# Altium project TPS65217_Test_Bd.PrjPcb
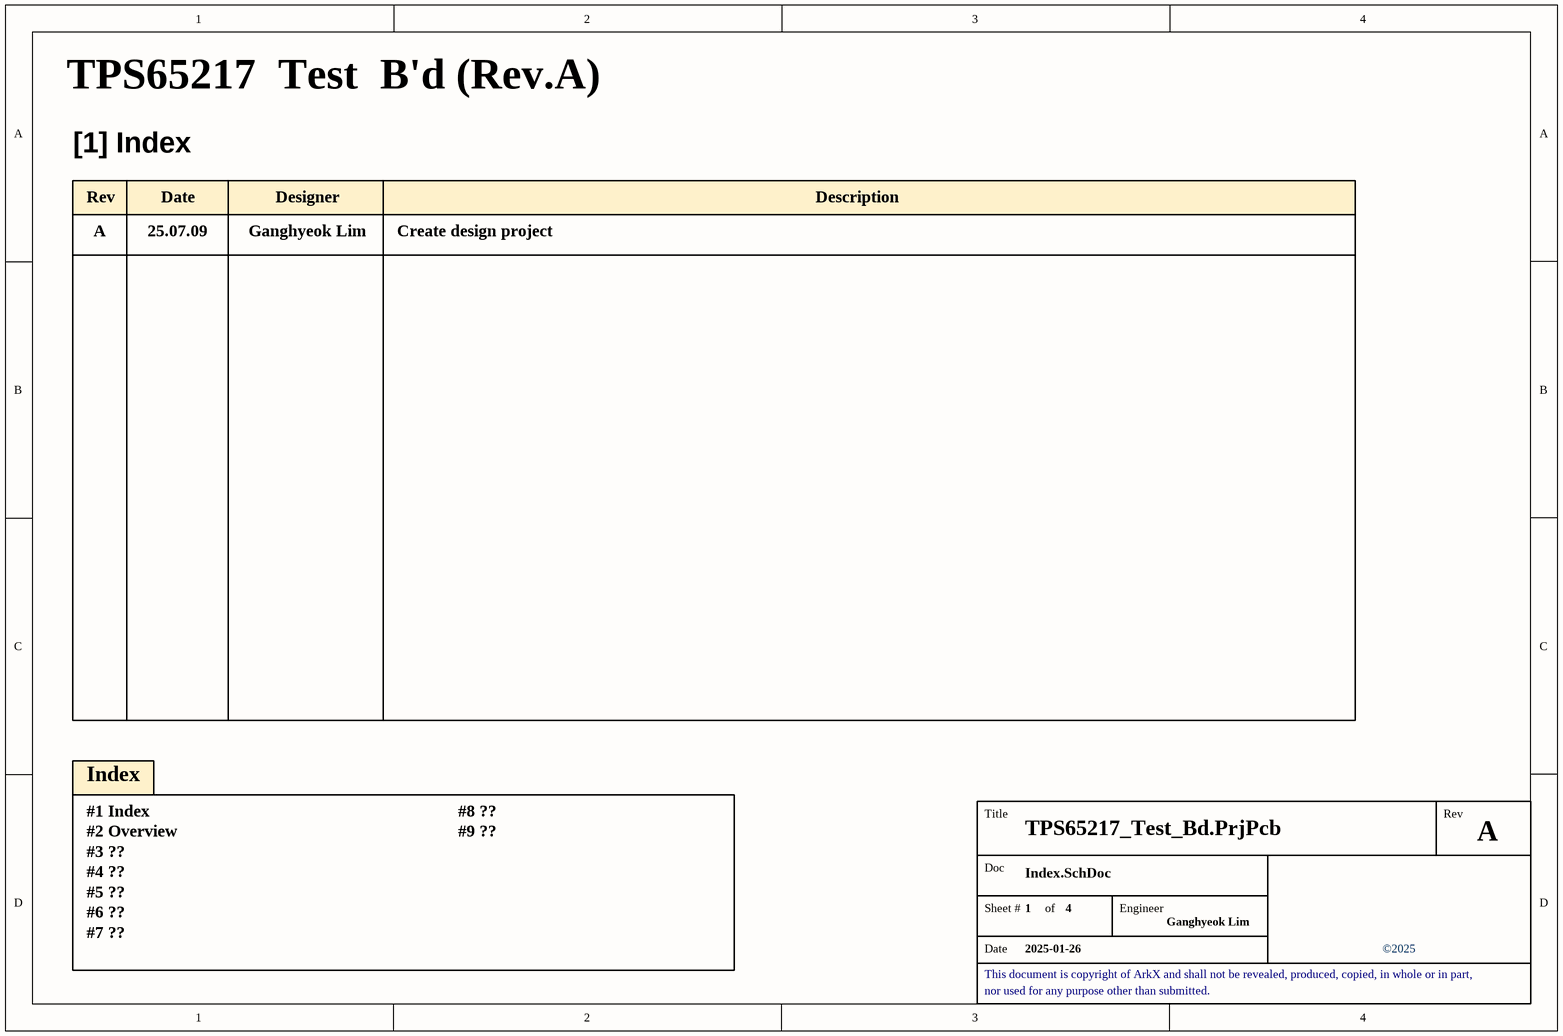
[diagram p0: Index.SchDoc]
5 sheets, 111 parts. Net scope: flat (ports and power ports of the same name join across sheets).
Board file: TPS65217_Test_Bd.PcbDoc
Sheets:
  Index.SchDoc
  Overview.SchDoc
  TPS65217DRSLR.SchDoc
  MCU.SchDoc
  Connector.SchDoc

## Sheet Index.SchDoc
size A4; Date: 2025-01-26; Engineer: Ganghyeok Lim; Revision: A; SheetNumber: 1; SheetTotal: 4

### Notes on the sheet
- TPS65217  Test  B'd (Rev.A)
- [1] Index
- Rev
- A
- 25.07.09
- Date
- Ganghyeok Lim
- Designer
- Create design project
- Description
- Index
- #1 Index
- #2 Overview
- #8 ??
- #9 ??
- #3 ??
- #4 ??
- #5 ??
- #6 ??
- #7 ??
- Title
- Doc
- Sheet #
- of
- Engineer
- This document is copyright of ArkX and shall not be revealed, produced, copied, in whole or in part,
- ©2025
- nor used for any purpose other than submitted.

## Sheet Overview.SchDoc
size A4; SheetNumber: 2; SheetTotal: 4
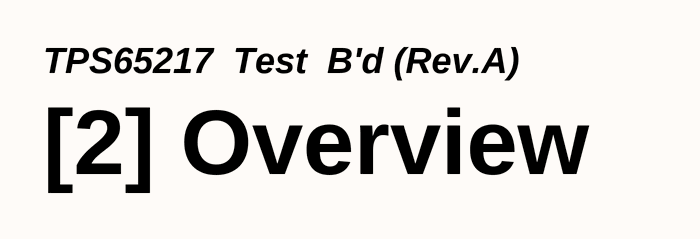
[diagram p1: Overview.SchDoc]

### Notes on the sheet
- TPS65217  Test  B'd (Rev.A)
- [2] Overview
- Title
- Rev
- Doc
- Sheet #
- of
- Engineer
- This document is copyright of ArkX and shall not be revealed, produced, copied, in whole or in part,
- Date
- nor used for any purpose other than submitted.

## Sheet TPS65217DRSLR.SchDoc
size A3; SheetNumber: 3; SheetTotal: 5
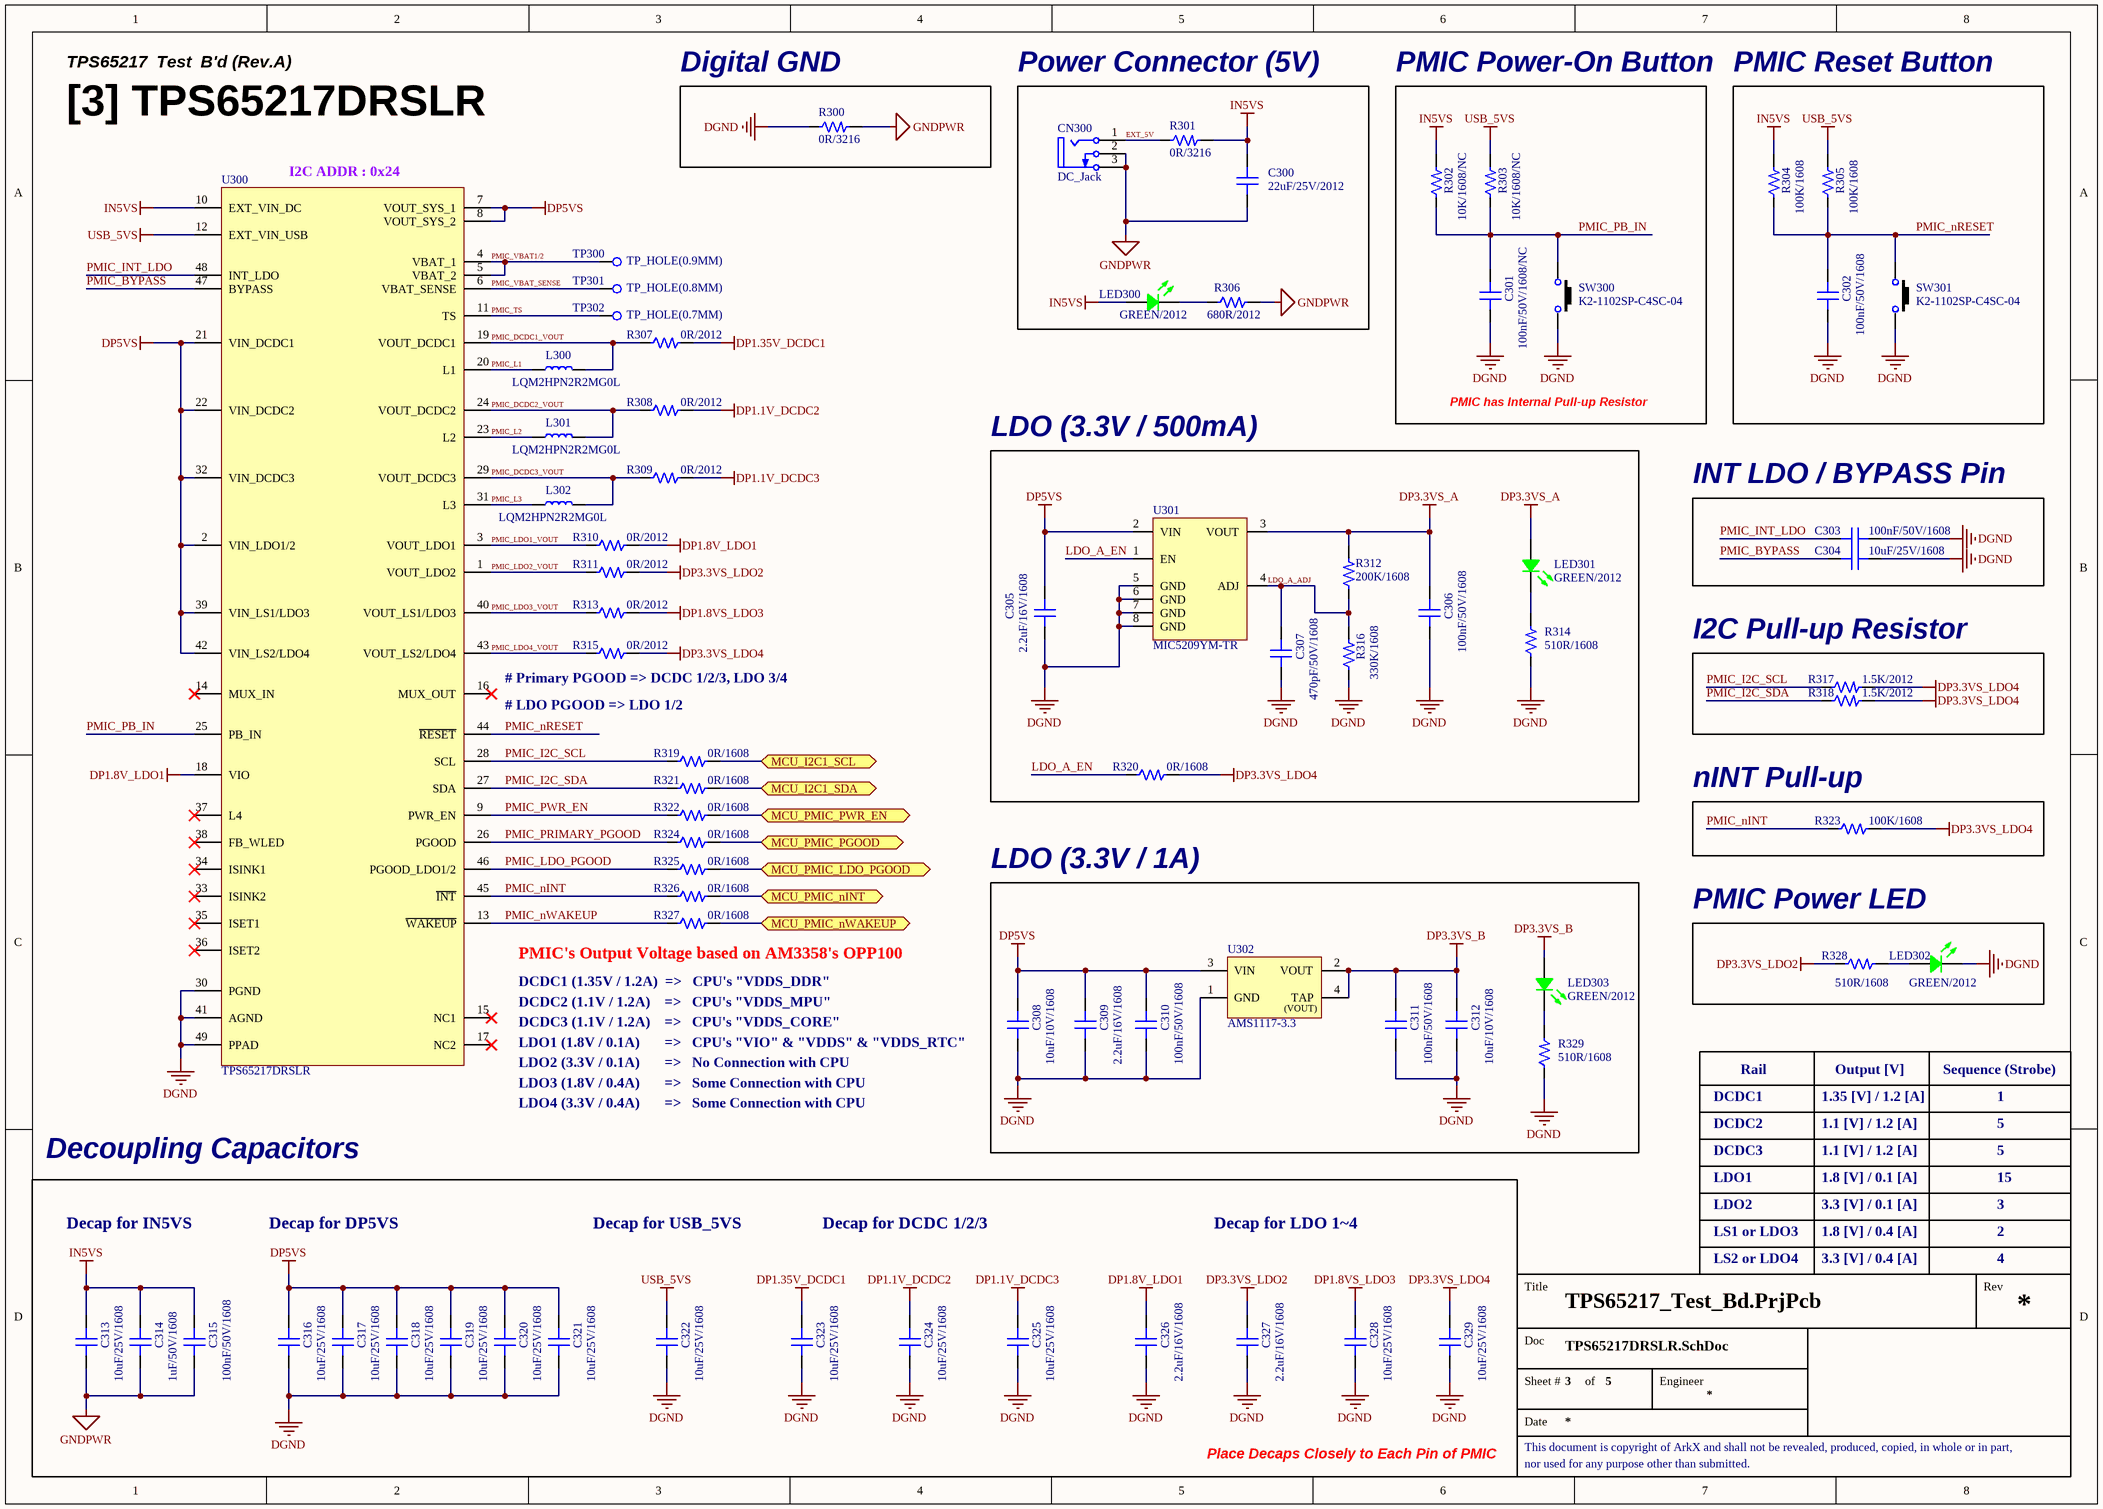
[diagram p2: TPS65217DRSLR.SchDoc]

### Parts
C300  22uF/25V/2012  [CAP 2012 (0805_INCH)]
C301  100nF/50V/1608/NC  [CAP 1608 (0603_INCH)/NC]
C302  100nF/50V/1608  [CAP 1608 (0603_INCH)]
C303  100nF/50V/1608  [CAP 1608 (0603_INCH)]
C304  10uF/25V/1608  [CAP 1608 (0603_INCH)]
C305  2.2uF/16V/1608  [CAP 1608 (0603_INCH)]
C306  100nF/50V/1608  [CAP 1608 (0603_INCH)]
C307  470pF/50V/1608  [CAP 1608 (0603_INCH)]
C308  10uF/10V/1608  [CAP 1608 (0603_INCH)]
C309  2.2uF/16V/1608  [CAP 1608 (0603_INCH)]
C310  100nF/50V/1608  [CAP 1608 (0603_INCH)]
C311  100nF/50V/1608  [CAP 1608 (0603_INCH)]
C312  10uF/10V/1608  [CAP 1608 (0603_INCH)]
C313  10uF/25V/1608  [CAP 1608 (0603_INCH)]
C314  1uF/50V/1608  [CAP 1608 (0603_INCH)]
C315  100nF/50V/1608  [CAP 1608 (0603_INCH)]
C316  10uF/25V/1608  [CAP 1608 (0603_INCH)]
C317  10uF/25V/1608  [CAP 1608 (0603_INCH)]
C318  10uF/25V/1608  [CAP 1608 (0603_INCH)]
C319  10uF/25V/1608  [CAP 1608 (0603_INCH)]
C320  10uF/25V/1608  [CAP 1608 (0603_INCH)]
C321  10uF/25V/1608  [CAP 1608 (0603_INCH)]
C322  10uF/25V/1608  [CAP 1608 (0603_INCH)]
C323  10uF/25V/1608  [CAP 1608 (0603_INCH)]
C324  10uF/25V/1608  [CAP 1608 (0603_INCH)]
C325  10uF/25V/1608  [CAP 1608 (0603_INCH)]
C326  2.2uF/16V/1608  [CAP 1608 (0603_INCH)]
C327  2.2uF/16V/1608  [CAP 1608 (0603_INCH)]
C328  10uF/25V/1608  [CAP 1608 (0603_INCH)]
C329  10uF/25V/1608  [CAP 1608 (0603_INCH)]
CN300  DC_Jack  [CON_DC-JACK]
L300  LQM2HPN2R2MG0L  [IND_LQM2HPN2R2MG0L]
L301  LQM2HPN2R2MG0L  [IND_LQM2HPN2R2MG0L]
L302  LQM2HPN2R2MG0L  [IND_LQM2HPN2R2MG0L]
LED300  GREEN/2012  [LED MHT170RGBCT (GREEN)]
LED301  GREEN/2012  [LED MHT170RGBCT (GREEN)]
LED302  GREEN/2012  [LED MHT170RGBCT (GREEN)]
LED303  GREEN/2012  [LED MHT170RGBCT (GREEN)]
R300  0R/3216  [RES 3216 (1206_inch)]
R301  0R/3216  [RES 3216 (1206_inch)]
R302  10K/1608/NC  [RES 1608 (0603_inch)/NC]
R303  10K/1608/NC  [RES 1608 (0603_inch)/NC]
R304  100K/1608  [RES 1608 (0603_inch)]
R305  100K/1608  [RES 1608 (0603_inch)]
R306  680R/2012  [RES 2012 (0805_inch)]
R307  0R/2012  [RES 2012 (0805_inch)]
R308  0R/2012  [RES 2012 (0805_inch)]
R309  0R/2012  [RES 2012 (0805_inch)]
R310  0R/2012  [RES 2012 (0805_inch)]
R311  0R/2012  [RES 2012 (0805_inch)]
R312  200K/1608  [RES 1608 (0603_inch)]
R313  0R/2012  [RES 2012 (0805_inch)]
R314  510R/1608  [RES 1608 (0603_inch)]
R315  0R/2012  [RES 2012 (0805_inch)]
R316  330K/1608  [RES 1608 (0603_inch)]
R317  1.5K/2012  [RES 2012 (0805_inch)]
R318  1.5K/2012  [RES 2012 (0805_inch)]
R319  0R/1608  [RES 1608 (0603_inch)]
R320  0R/1608  [RES 1608 (0603_inch)]
R321  0R/1608  [RES 1608 (0603_inch)]
R322  0R/1608  [RES 1608 (0603_inch)]
R323  100K/1608  [RES 1608 (0603_inch)]
R324  0R/1608  [RES 1608 (0603_inch)]
R325  0R/1608  [RES 1608 (0603_inch)]
R326  0R/1608  [RES 1608 (0603_inch)]
R327  0R/1608  [RES 1608 (0603_inch)]
R328  510R/1608  [RES 1608 (0603_inch)]
R329  510R/1608  [RES 1608 (0603_inch)]
SW300  K2-1102SP-C4SC-04  [SW K2-1102SP-C4SC-04]
SW301  K2-1102SP-C4SC-04  [SW K2-1102SP-C4SC-04]
TP300  TP_HOLE(0.9MM)  [TP_HOLE(0.9MM)]
TP301  TP_HOLE(0.8MM)  [TP_HOLE(0.8MM)]
TP302  TP_HOLE(0.7MM)  [TP_HOLE(0.7MM)]
U300  TPS65217DRSLR  [IC_VQFN-48(6x6)]
U301  MIC5209YM-TR  [IC_SOIC-8 (4.90x3.90mm)]
U302  AMS1117-3.3  [SOT 223-3 (DIODES INCORPORATED)]

### Blocks framed on the sheet
Digital GND: R300
Power Connector (5V): C300 CN300 LED300 R301 R306
PMIC Power-On Button: C301 R302 R303 SW300
PMIC Reset Button: C302 R304 R305 SW301
LDO (3.3V / 500mA): C305-C307 LED301 R312 R314 R316 R320 U301
INT LDO / BYPASS Pin: C303 C304
I2C Pull-up Resistor: R317 R318
nINT Pull-up: R323
LDO (3.3V / 1A): C308-C312 LED303 R329 U302
PMIC Power LED: LED302 R328
Decoupling Capacitors: C313-C329

### Ports
MCU_I2C1_SCL (bidir), MCU_I2C1_SDA (bidir), MCU_PMIC_LDO_PGOOD (bidir), MCU_PMIC_nINT (bidir), MCU_PMIC_nWAKEUP (bidir), MCU_PMIC_PGOOD (bidir), MCU_PMIC_PWR_EN (bidir)

### Nets
DGND: C301.1 C302.1 C303.1 C304.1 C305.1 C306.1 C307.1 C308.1 C309.1 C310.1 C311.1 C312.1 C316.1 C317.1 C318.1 C319.1 C320.1 C321.1 C322.1 C323.1 C324.1 C325.1 C326.1 C327.1 C328.1 C329.1 LED302.2(GREEN) R300.1 R314.1 R316.1 R329.1 SW300.3 SW301.3 U300.30(PGND) U300.41(AGND) U300.49(PPAD) U301.5(GND) U301.6(GND) U301.7(GND) U301.8(GND) U302.1(GND)
DP1.1V_DCDC2: C324.2 R308.2
DP1.1V_DCDC3: C325.2 R309.2
DP1.8V_LDO1: C326.2 R310.2 U300.18(VIO)
DP1.8VS_LDO3: C328.2 R313.2
DP1.35V_DCDC1: C323.2 R307.2
DP3.3VS_A: C306.2 LED301.4(Common_Anode) R312.2 U301.3(VOUT)
DP3.3VS_B: C311.2 C312.2 LED303.4(Common_Anode) U302.2(VOUT) U302.4(TAP)
DP3.3VS_LDO2: C327.2 R311.2 R328.1
DP3.3VS_LDO4: C329.2 R315.2 R317.2 R318.2 R320.2 R323.2
DP5VS: C305.2 C308.2 C309.2 C310.2 C316.2 C317.2 C318.2 C319.2 C320.2 C321.2 U300.2(VIN_LDO1/2) U300.7(VOUT_SYS_1) U300.8(VOUT_SYS_2) U300.21(VIN_DCDC1) U300.22(VIN_DCDC2) U300.32(VIN_DCDC3) U300.39(VIN_LS1/LDO3) U300.42(VIN_LS2/LDO4) U301.2(VIN) U302.3(VIN)
GNDPWR: C300.1 C313.1 C314.1 C315.1 CN300.2(GND) CN300.3(GND) R300.2 R306.2
IN5VS: C300.2 C313.2 C314.2 C315.2 LED300.4(Common_Anode) R301.2 R302.2 R304.2 U300.10(EXT_VIN_DC)
USB_5VS: C322.2 R303.2 R305.2 U300.12(EXT_VIN_USB)
EXT_5V: CN300.1(VCC) R301.1
LDO_A_ADJ: C307.2 R312.1 R316.2 U301.4(ADJ)
LDO_A_EN: R320.1 U301.1(EN)
MCU_I2C1_SCL: R319.2 ; port MCU_I2C1_SCL
MCU_I2C1_SDA: R321.2 ; port MCU_I2C1_SDA
MCU_PMIC_LDO_PGOOD: R325.2 ; port MCU_PMIC_LDO_PGOOD
MCU_PMIC_nINT: R326.2 ; port MCU_PMIC_nINT
MCU_PMIC_nWAKEUP: R327.2 ; port MCU_PMIC_nWAKEUP
MCU_PMIC_PGOOD: R324.2 ; port MCU_PMIC_PGOOD
MCU_PMIC_PWR_EN: R322.2 ; port MCU_PMIC_PWR_EN
PMIC_BYPASS: C304.2 U300.47(BYPASS)
PMIC_DCDC1_VOUT: L300.2 R307.1 U300.19(VOUT_DCDC1)
PMIC_DCDC2_VOUT: L301.2 R308.1 U300.24(VOUT_DCDC2)
PMIC_DCDC3_VOUT: L302.2 R309.1 U300.29(VOUT_DCDC3)
PMIC_I2C_SCL: R317.1 R319.1 U300.28(SCL)
PMIC_I2C_SDA: R318.1 R321.1 U300.27(SDA)
PMIC_INT_LDO: C303.2 U300.48(INT_LDO)
PMIC_L1: L300.1 U300.20(L1)
PMIC_L2: L301.1 U300.23(L2)
PMIC_L3: L302.1 U300.31(L3)
PMIC_LDO1_VOUT: R310.1 U300.3(VOUT_LDO1)
PMIC_LDO2_VOUT: R311.1 U300.1(VOUT_LDO2)
PMIC_LDO3_VOUT: R313.1 U300.40(VOUT_LS1/LDO3)
PMIC_LDO4_VOUT: R315.1 U300.43(VOUT_LS2/LDO4)
PMIC_LDO_PGOOD: R325.1 U300.46(PGOOD_LDO1/2)
PMIC_nINT: R323.1 R326.1 U300.45(~{INT})
PMIC_nRESET: C302.2 R304.1 R305.1 SW301.1 U300.44(~{RESET})
PMIC_nWAKEUP: R327.1 U300.13(~{WAKEUP})
PMIC_PB_IN: C301.2 R302.1 R303.1 SW300.1 U300.25(PB_IN)
PMIC_PRIMARY_PGOOD: R324.1 U300.26(PGOOD)
PMIC_PWR_EN: R322.1 U300.9(PWR_EN)
PMIC_TS: TP302.1(TP) U300.11(TS)
PMIC_VBAT1/2: TP300.1(TP) U300.4(VBAT_1) U300.5(VBAT_2)
PMIC_VBAT_SENSE: TP301.1(TP) U300.6(VBAT_SENSE)
NetLED300_2: LED300.2(GREEN) R306.1
NetLED301_2: LED301.2(GREEN) R314.2
NetLED302_4: LED302.4(Common_Anode) R328.2
NetLED303_2: LED303.2(GREEN) R329.2

Not connected (* = marked no-connect by the designer): U300 14(MUX_IN)* 15(NC1)* 16(MUX_OUT)* 17(NC2)* 33(ISINK2)* 34(ISINK1)* 35(ISET1)* 36(ISET2)* 37(L4)* 38(FB_WLED)*

### Notes on the sheet
- TPS65217  Test  B'd (Rev.A)
- [3] TPS65217DRSLR
- (near U300) I2C ADDR : 0x24
- PMIC has Internal Pull-up Resistor
- # LDO PGOOD => LDO 1/2
- (near R315) # Primary PGOOD => DCDC 1/2/3, LDO 3/4
- DCDC1 (1.35V / 1.2A)  =>   CPU's "VDDS_DDR"
- (near R327) PMIC's Output Voltage based on AM3358's OPP100
- DCDC2 (1.1V / 1.2A)    =>   CPU's "VDDS_MPU"
- DCDC3 (1.1V / 1.2A)    =>   CPU's "VDDS_CORE"
- LDO1 (1.8V / 0.1A)       =>   CPU's "VIO" & "VDDS" & "VDDS_RTC"
- LDO2 (3.3V / 0.1A)       =>   No Connection with CPU
- LDO3 (1.8V / 0.4A)       =>   Some Connection with CPU
- LDO4 (3.3V / 0.4A)       =>   Some Connection with CPU
- DCDC1
- DCDC2
- Rail
- 1.35 [V] / 1.2 [A]
- 1.1 [V] / 1.2 [A]
- Output [V]
- Sequence (Strobe)
- 1
- 5
- DCDC3
- LDO1
- 1.8 [V] / 0.1 [A]
- 15
- Decap for IN5VS
- Decap for DP5VS
- Decap for USB_5VS
- Decap for DCDC 1/2/3
- Decap for LDO 1~4
- LDO2
- LS1 or LDO3
- LS2 or LDO4
- 3.3 [V] / 0.1 [A]
- 1.8 [V] / 0.4 [A]
- 3.3 [V] / 0.4 [A]
- 3
- 2
- 4
- Place Decaps Closely to Each Pin of PMIC
- Title
- Rev
- Doc
- Sheet #
- of
- Engineer
- This document is copyright of ArkX and shall not be revealed, produced, copied, in whole or in part,
- Date
- nor used for any purpose other than submitted.
- (in symbol IC_REG_AMS1117-3.3) (VOUT)

### Library data of the parts
C300 = CAP_22uF/25V/2012: Ceramic CAP_22uF/25V/2012; LCSC Part #: C45783; JLCPCB Part Type: Basic Part
C301 = CAP_NC_100nF/50V/1608: Ceramic CAP_100nF/50V/1608
C302 C303 C306 C310 C311 C315 = CAP_100nF/50V/1608: Ceramic CAP_100nF/50V/1608; LCSC Part #: C14663; JLCPCB Part Type: Basic Part
C304 C313 C316-C325 C328 C329 = CAP_10uF/25V/1608: Ceramic CAP_10uF/25V/1608; LCSC Part #: C96446; JLCPCB Part Type: Basic Part
C305 C309 C326 C327 = CAP_2.2uF/16V/1608: Ceramic CAP_2.2uF/16V/1608; LCSC Part #: C23630; JLCPCB Part Type: Basic Part
C307 = CAP_470pF/50V/1608: Ceramic CAP_470pF/50V/1608; LCSC Part #: C1620; JLCPCB Part Type: Basic Part
C308 C312 = CAP_10uF/10V/1608: Ceramic CAP_10uF/10V/1608; LCSC Part #: C19702; JLCPCB Part Type: Basic Part
C314 = CAP_1uF/50V/1608: Ceramic CAP_1uF/50V/1608; LCSC Part #: C15849; JLCPCB Part Type: Basic Part
CN300 = CON_DC-Jack: ComponentLink1Description: Manufacturer Link; ComponentLink1URL: http://www.cliffuk.co.uk/
L300-L302 = IND_LQM2HPN2R2MG0L: 2.2 µH Shielded Multilayer Inductor 1.3 A 100mOhm Max 1008 (2520 Metric); LCSC Part #: C86092; JLCPCB Part Type: Extended Part
LED300-LED303 = LED_MHT170RGBCT(GREEN): Colorless transparence -30℃~+85℃ Positive post Common anode RGB 120° 0805  Light Emitting Diodes (LED) ROHS; LCSC Part #: C2962094; JLCPCB Part Type: Extended Part
R300 R301 = RES_0R/3216/0.25W: Power Rating: 0.1W; Precision: 1%; Size: 1608; LCSC Part #: C17888; JLCPCB Part Type: Basic Part
R302 R303 = RES_NC_10K/1608/0.1W: RES_10K/1608/0.1W; Value: 10K; Power Rating: 0.1W; Precision: 1%; Size: 1608
R304 R305 R323 = RES_100K/1608/0.1W: Value: 100K; Power Rating: 0.1W; Precision: 1%; Size: 1608; LCSC Part #: C25803; JLCPCB Part Type: Basic Part
R306 = RES_680R/2012/0.125W: Value: 680R; Power Rating: 0.125W; Precision: 1%; Size: 2012; LCSC Part #: C17798; JLCPCB Part Type: Basic Part
R307-R311 R313 R315 = RES_0R/2012/0.125W: Value: 0R; Power Rating: 0.125W; Precision: 1%; Size: 2012; LCSC Part #: C17477; JLCPCB Part Type: Basic Part
R312 = RES_200K/1608/0.1W: Value: 200K; Power Rating: 0.1W; Precision: 1%; Size: 1608; LCSC Part #: C25811; JLCPCB Part Type: Basic Part
R314 R328 R329 = RES_510R/1608/0.1W: Value: 510R; Power Rating: 0.1W; Precision: 1%; Size: 1608; LCSC Part #: C23193; JLCPCB Part Type: Basic Part
R316 = RES_330K/1608/0.1W: Value: 330K; Power Rating: 0.1W; Precision: 1%; Size: 1608; LCSC Part #: C23137; JLCPCB Part Type: Basic Part
R317 R318 = RES_1.5K/2012/0.125W: Value: 1.5K; Power Rating: 0.125W; Precision: 1%; Size: 2012; LCSC Part #: C4310; JLCPCB Part Type: Basic Part
R319-R322 R324-R327 = RES_0R/1608/0.1W: Value: 0R; Power Rating: 0.1W; Precision: 1%; Size: 1608; LCSC Part #: C21189; JLCPCB Part Type: Basic Part
SW300 SW301 = SW_K2-1102SP-C4SC-04(2P): -25℃~+85℃ 6mm 5mm Round Button 50mA Brick nogging 6mm SPST 100MΩ 100000 250gf@±30gf 12V SMD  Tactile Switches ROHS; LCSC Part #: C127509; JLCPCB Part Type: Extended Part
U300 = IC_PMIC_TPS65217DRSLR: Battery Management, Display (LED Drivers), Handheld/Mobile Devices, Power Supply PMIC 48-VQFN (6x6); ComponentLink1Description: Datasheet; ComponentLink1URL: https://www.mouser.kr/datasheet/2/609/8023fj-2488599.pdf; LCSC Part #: C702315; JLCPCB Part Type: Extended Part
U301 = IC_REG_MIC5209YM-TR: Linear Voltage Regulator IC Positive Adjustable 1 Output 500mA 8-SOIC; LCSC Part #: C461593; JLCPCB Part Type: Extended Part
U302 = IC_REG_AMS1117-3.3: 72dB@(120Hz) 1A 1.3V@(800mA) Fixed 3.3V~3.3V Positive 1 SOT-223  Linear Voltage Regulators (LDO) ROHS; LCSC Part #: C6186; JLCPCB Part Type: Basic Part

## Sheet MCU.SchDoc
size A4; SheetNumber: 4; SheetTotal: 5
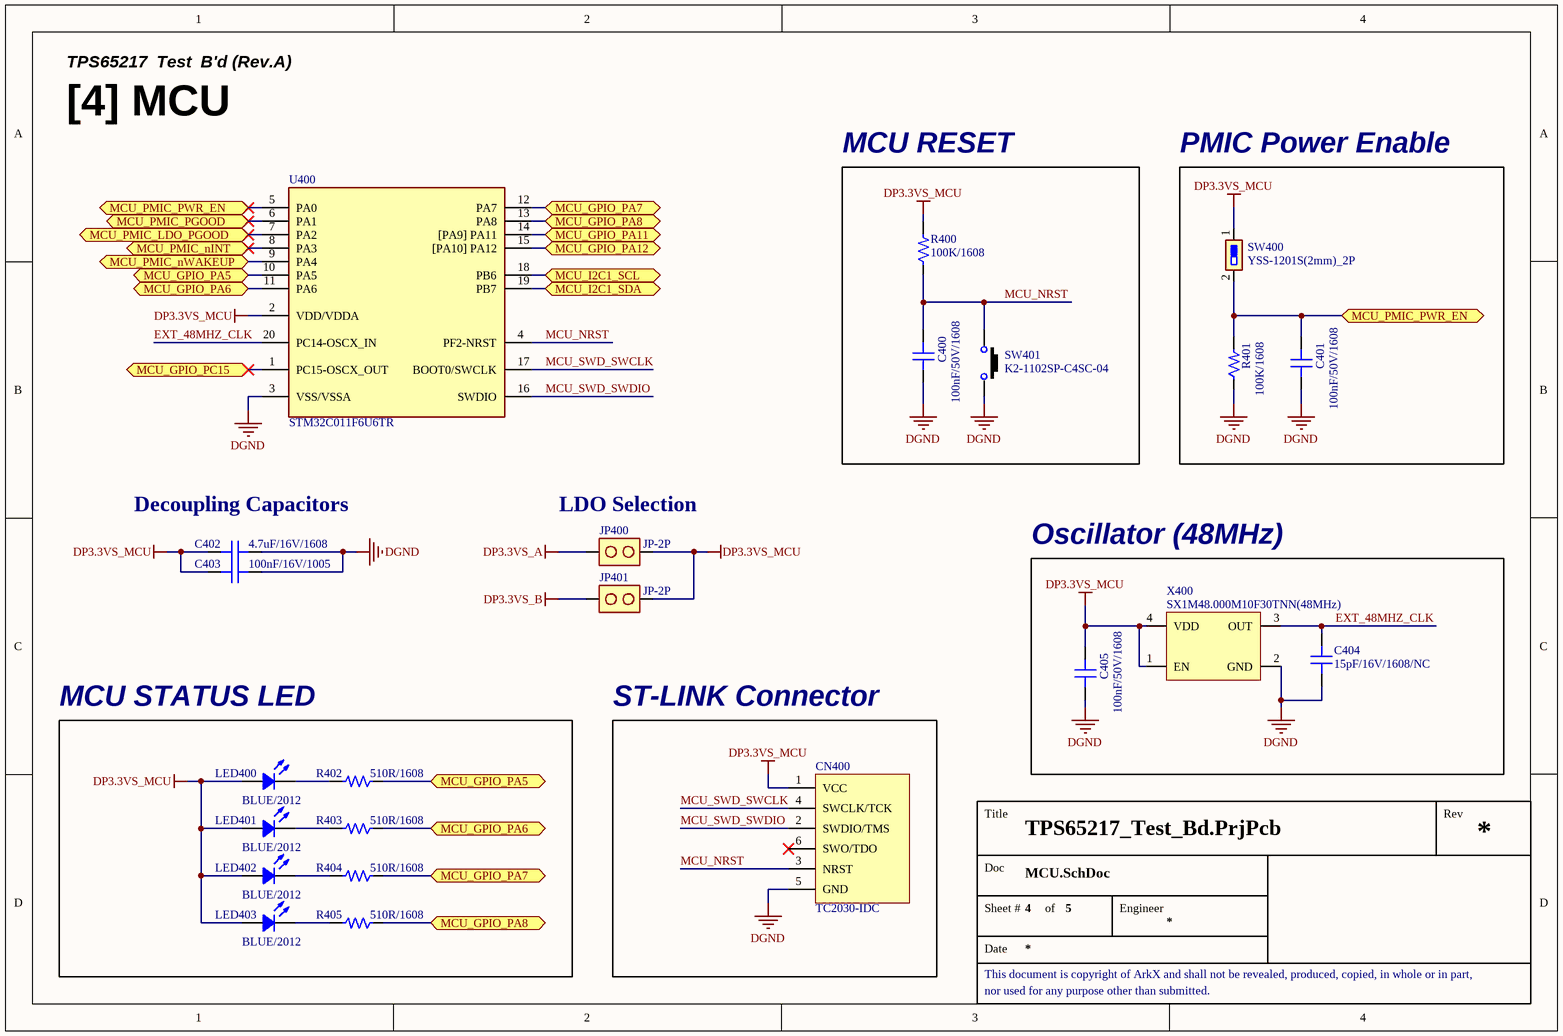
[diagram p3: MCU.SchDoc]

### Parts
C400  100nF/50V/1608  [CAP 1608 (0603_INCH)]
C401  100nF/50V/1608  [CAP 1608 (0603_INCH)]
C402  4.7uF/16V/1608  [CAP 1608 (0603_INCH)]
C403  100nF/16V/1005  [CAP 1005 (0402_INCH)]
C404  15pF/16V/1608/NC  [CAP 1608 (0603_INCH)/NC]
C405  100nF/50V/1608  [CAP 1608 (0603_INCH)]
CN400  TC2030-IDC  [CON_TC2030-IDC]  (no BOM)
JP400  JP-2P  [CON PIN_HEADER-2PIN(2.54MM)]
JP401  JP-2P  [CON PIN_HEADER-2PIN(2.54MM)]
LED400  BLUE/2012  [LED MHT170RGBCT (BLUE)]
LED401  BLUE/2012  [LED MHT170RGBCT (BLUE)]
LED402  BLUE/2012  [LED MHT170RGBCT (BLUE)]
LED403  BLUE/2012  [LED MHT170RGBCT (BLUE)]
R400  100K/1608  [RES 1608 (0603_inch)]
R401  100K/1608  [RES 1608 (0603_inch)]
R402  510R/1608  [RES 1608 (0603_inch)]
R403  510R/1608  [RES 1608 (0603_inch)]
R404  510R/1608  [RES 1608 (0603_inch)]
R405  510R/1608  [RES 1608 (0603_inch)]
SW400  YSS-1201S(2mm)_2P  [SW YSS-1201S-2mm]
SW401  K2-1102SP-C4SC-04  [SW K2-1102SP-C4SC-04]
U400  STM32C011F6U6TR  [IC_UFQFPN-20]
X400  SX1M48.000M10F30TNN(48MHz)  [OSC_SMD2016-4P]

### Blocks framed on the sheet
MCU RESET: C400 R400 SW401
PMIC Power Enable: C401 R401 SW400
Oscillator (48MHz): C404 C405 X400
MCU STATUS LED: LED400-LED403 R402-R405
ST-LINK Connector: CN400

### Ports
MCU_GPIO_PA5 (bidir), MCU_GPIO_PA6 (bidir), MCU_GPIO_PA7 (bidir), MCU_GPIO_PA8 (bidir), MCU_GPIO_PA11 (bidir), MCU_GPIO_PA12 (bidir), MCU_GPIO_PC15 (bidir), MCU_I2C1_SCL (bidir), MCU_I2C1_SDA (bidir), MCU_PMIC_LDO_PGOOD (bidir), MCU_PMIC_nINT (bidir), MCU_PMIC_nWAKEUP (bidir), MCU_PMIC_PGOOD (bidir), MCU_PMIC_PWR_EN (bidir)

### Nets
DGND: C400.1 C401.1 C402.1 C403.1 C404.1 C405.1 CN400.5(GND) R401.1 SW401.3 U400.3(VSS/VSSA) X400.2(GND)
DP3.3VS_A: JP400.1
DP3.3VS_B: JP401.1
DP3.3VS_MCU: C402.2 C403.2 C405.2 CN400.1(VCC) JP400.2 JP401.2 LED400.4(Common_Anode) LED401.4(Common_Anode) LED402.4(Common_Anode) LED403.4(Common_Anode) R400.2 SW400.1 U400.2(VDD/VDDA) X400.1(EN) X400.4(VDD)
EXT_48MHZ_CLK: C404.2 U400.20(PC14-OSCX_IN) X400.3(OUT)
MCU_GPIO_PA5: R402.1 U400.10(PA5) ; port MCU_GPIO_PA5
MCU_GPIO_PA6: R403.1 U400.11(PA6) ; port MCU_GPIO_PA6
MCU_GPIO_PA7: R404.1 U400.12(PA7) ; port MCU_GPIO_PA7
MCU_GPIO_PA8: R405.1 U400.13(PA8) ; port MCU_GPIO_PA8
MCU_GPIO_PA11: U400.14([PA9]_PA11) ; port MCU_GPIO_PA11
MCU_GPIO_PA12: U400.15([PA10]_PA12) ; port MCU_GPIO_PA12
MCU_GPIO_PC15: U400.1(PC15-OSCX_OUT) ; port MCU_GPIO_PC15
MCU_I2C1_SCL: U400.18(PB6) ; port MCU_I2C1_SCL
MCU_I2C1_SDA: U400.19(PB7) ; port MCU_I2C1_SDA
MCU_NRST: C400.2 CN400.3(NRST) R400.1 SW401.1 U400.4(PF2-NRST)
MCU_PMIC_LDO_PGOOD: U400.7(PA2) ; port MCU_PMIC_LDO_PGOOD
MCU_PMIC_nINT: U400.8(PA3) ; port MCU_PMIC_nINT
MCU_PMIC_nWAKEUP: U400.9(PA4) ; port MCU_PMIC_nWAKEUP
MCU_PMIC_PGOOD: U400.6(PA1) ; port MCU_PMIC_PGOOD
MCU_PMIC_PWR_EN: C401.2 R401.2 SW400.2 U400.5(PA0) ; port MCU_PMIC_PWR_EN
MCU_SWD_SWCLK: CN400.4(SWCLK/TCK) U400.17(BOOT0/SWCLK)
MCU_SWD_SWDIO: CN400.2(SWDIO/TMS) U400.16(SWDIO)
NetLED400_3: LED400.3(BLUE) R402.2
NetLED401_3: LED401.3(BLUE) R403.2
NetLED402_3: LED402.3(BLUE) R404.2
NetLED403_3: LED403.3(BLUE) R405.2

Not connected (* = marked no-connect by the designer): CN400 6(SWO/TDO)*

### Notes on the sheet
- TPS65217  Test  B'd (Rev.A)
- [4] MCU
- Decoupling Capacitors
- (near JP400) LDO Selection
- Title
- Rev
- Doc
- Sheet #
- of
- Engineer
- This document is copyright of ArkX and shall not be revealed, produced, copied, in whole or in part,
- Date
- nor used for any purpose other than submitted.

### Library data of the parts
C400 C401 C405 = CAP_100nF/50V/1608: Ceramic CAP_100nF/50V/1608; LCSC Part #: C14663; JLCPCB Part Type: Basic Part
C402 = CAP_4.7uF/16V/1608: Ceramic CAP_4.7uF/16V/1608; LCSC Part #: C19666; JLCPCB Part Type: Basic Part
C403 = CAP_100nF/16V/1005: Ceramic CAP_100nF/16V/1005; LCSC Part #: C1525; JLCPCB Part Type: Basic Part
C404 = CAP_NC_15pF/16V/1608: Ceramic CAP_15pF/16V/1608
CN400 = CON_TC2030-IDC(ST-LINK): Tag-Connect No-Solder SWD Debug Connector DO NOT PLACE; Manufacturer Part Number: TC2030; Manufacturer: Tag-Connect
JP400 JP401 = CON_JP-2P
LED400-LED403 = LED_MHT170RGBCT(BLUE): Colorless transparence -30℃~+85℃ Positive post Common anode RGB 120° 0805  Light Emitting Diodes (LED) ROHS; LCSC Part #: C2962094; JLCPCB Part Type: Extended Part
R400 R401 = RES_100K/1608/0.1W: as R304 on sheet TPS65217DRSLR; Size: 1608; LCSC Part #: C25803; JLCPCB Part Type: Basic Part
R402-R405 = RES_510R/1608/0.1W: as R314 on sheet TPS65217DRSLR; Size: 1608; LCSC Part #: C23193; JLCPCB Part Type: Basic Part
SW400 = SW_YSS-1201S(2mm)_2P: SMD Slide Switch. / Rating : DC 6V/0.3A / Travel : 2MM
SW401 = SW_K2-1102SP-C4SC-04(2P): as SW300 on sheet TPS65217DRSLR; LCSC Part #: C127509; JLCPCB Part Type: Extended Part
U400 = IC_MCU_STM32C011F6U6TR: ARM® Cortex®-M0+ STM32C0 Microcontroller IC 32-Bit 48MHz 32KB (32K x 8) FLASH 20-UFQFPN (3x3); Manufacturer: STMicroelectronics; Manufacturer Part Number: STM32C011F6U6TR; Case/Package: UFQFPN20; LCSC Part #: C5456206; JLCPCB Part Type: Extended Part
X400 = OSC_SX1M48.000M10F30TNN(48MHz): 1.62V~3.63V ±10ppm CMOS 48MHz SMD2016-4P  Oscillators ROHS; LCSC Part #: C2901617; JLCPCB Part Type: Extended Part

## Sheet Connector.SchDoc
size A4; SheetNumber: 5; SheetTotal: 4
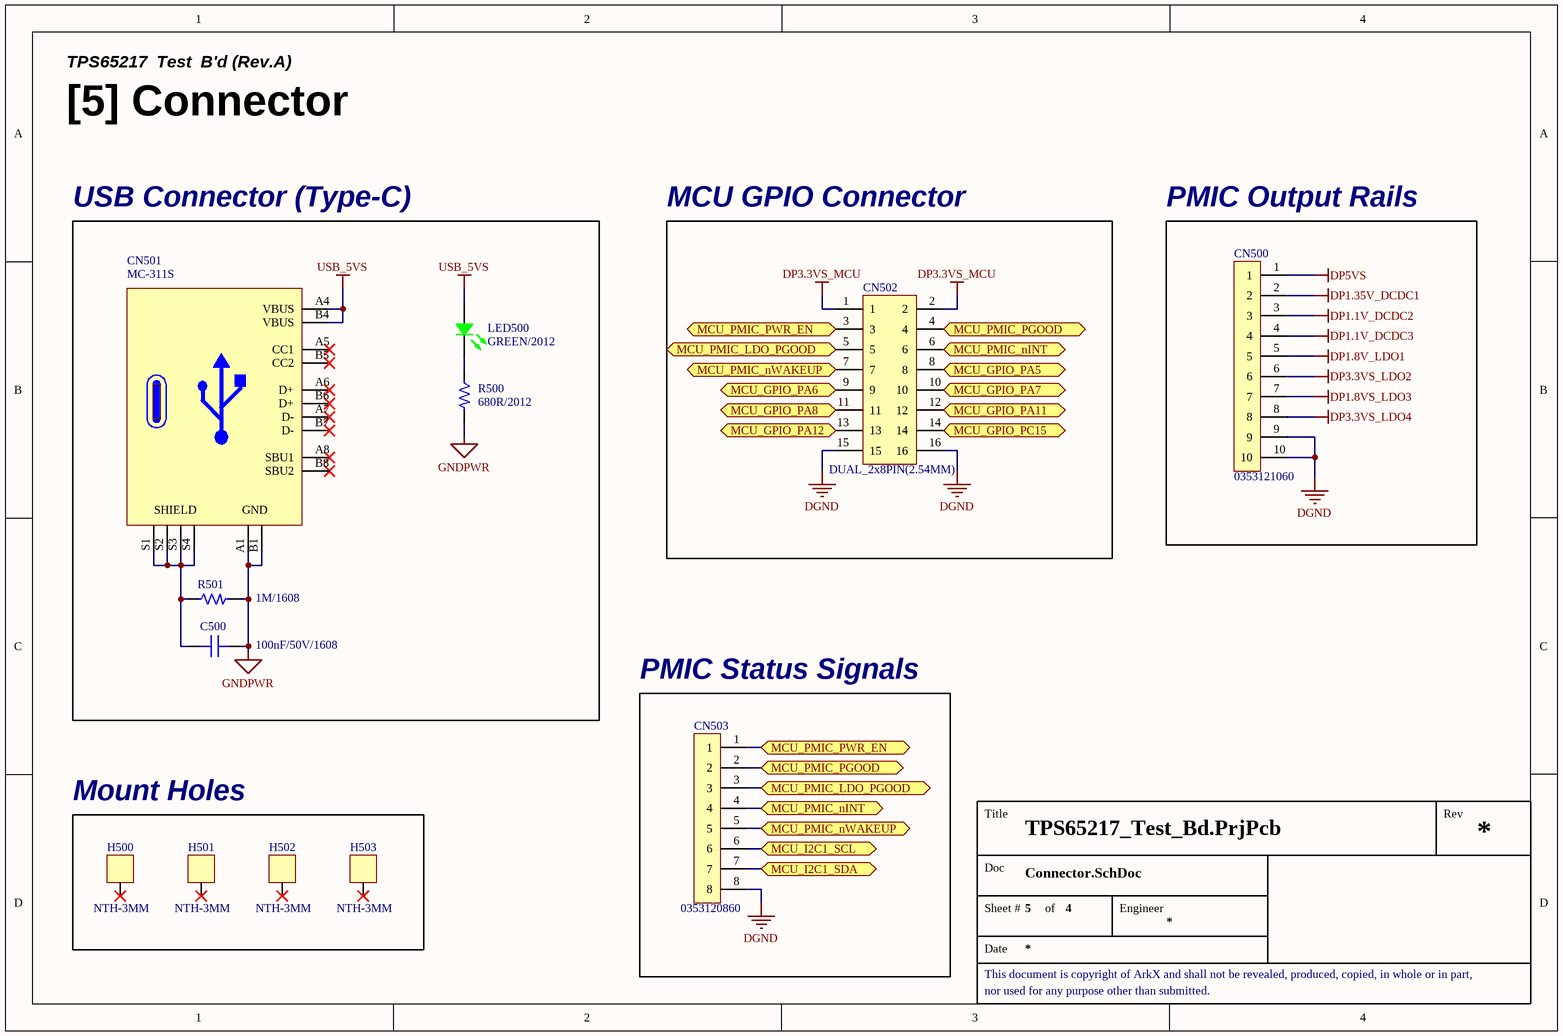
[diagram p4: Connector.SchDoc]

### Parts
C500  100nF/50V/1608  [CAP 1608 (0603_INCH)]
CN500  0353121060  [CON 0353121060 (MOLEX)]
CN501  MC-311S  [CON USB-Type-C (16P)]
CN502  DUAL_2x8PIN(2.54MM)  [CON PIN_HEADER_DUAL_2x8PIN(2.54MM)]
CN503  0353120860  [CON 0353120860 (MOLEX)]
H500  NTH-3MM  [HOLE NTH-3MM]
H501  NTH-3MM  [HOLE NTH-3MM]
H502  NTH-3MM  [HOLE NTH-3MM]
H503  NTH-3MM  [HOLE NTH-3MM]
LED500  GREEN/2012  [LED MHT170RGBCT (GREEN)]
R500  680R/2012  [RES 2012 (0805_inch)]
R501  1M/1608  [RES 1608 (0603_inch)]

### Blocks framed on the sheet
USB Connector (Type-C): C500 CN501 LED500 R500 R501
MCU GPIO Connector: CN502
PMIC Output Rails: CN500
PMIC Status Signals: CN503
Mount Holes: H500-H503

### Ports
MCU_GPIO_PA5 (bidir), MCU_GPIO_PA6 (bidir), MCU_GPIO_PA7 (bidir), MCU_GPIO_PA8 (bidir), MCU_GPIO_PA11 (bidir), MCU_GPIO_PA12 (bidir), MCU_GPIO_PC15 (bidir), MCU_I2C1_SCL (bidir), MCU_I2C1_SDA (bidir), MCU_PMIC_LDO_PGOOD (bidir), MCU_PMIC_nINT (bidir), MCU_PMIC_nWAKEUP (bidir), MCU_PMIC_PGOOD (bidir), MCU_PMIC_PWR_EN (bidir)

### Nets
DGND: CN500.9 CN500.10 CN502.15 CN502.16 CN503.8
DP1.1V_DCDC2: CN500.3
DP1.1V_DCDC3: CN500.4
DP1.8V_LDO1: CN500.5
DP1.8VS_LDO3: CN500.7
DP1.35V_DCDC1: CN500.2
DP3.3VS_LDO2: CN500.6
DP3.3VS_LDO4: CN500.8
DP3.3VS_MCU: CN502.1 CN502.2
DP5VS: CN500.1
GNDPWR: C500.2 CN501.A1(GND) CN501.B1(GND) R500.2 R501.2
USB_5VS: CN501.A4(VBUS) CN501.B4(VBUS) LED500.4(Common_Anode)
MCU_GPIO_PA5: CN502.8 ; port MCU_GPIO_PA5
MCU_GPIO_PA6: CN502.9 ; port MCU_GPIO_PA6
MCU_GPIO_PA7: CN502.10 ; port MCU_GPIO_PA7
MCU_GPIO_PA8: CN502.11 ; port MCU_GPIO_PA8
MCU_GPIO_PA11: CN502.12 ; port MCU_GPIO_PA11
MCU_GPIO_PA12: CN502.13 ; port MCU_GPIO_PA12
MCU_GPIO_PC15: CN502.14 ; port MCU_GPIO_PC15
MCU_I2C1_SCL: CN503.6 ; port MCU_I2C1_SCL
MCU_I2C1_SDA: CN503.7 ; port MCU_I2C1_SDA
MCU_PMIC_LDO_PGOOD: CN502.5 CN503.3 ; port MCU_PMIC_LDO_PGOOD
MCU_PMIC_nINT: CN502.6 CN503.4 ; port MCU_PMIC_nINT
MCU_PMIC_nWAKEUP: CN502.7 CN503.5 ; port MCU_PMIC_nWAKEUP
MCU_PMIC_PGOOD: CN502.4 CN503.2 ; port MCU_PMIC_PGOOD
MCU_PMIC_PWR_EN: CN502.3 CN503.1 ; port MCU_PMIC_PWR_EN
NetC500_1: C500.1 CN501.S1(SHIELD) CN501.S2(SHIELD) CN501.S3(SHIELD) CN501.S4(SHIELD) R501.1
NetLED500_2: LED500.2(GREEN) R500.1

Not connected (* = marked no-connect by the designer): CN501 A5(CC1)* A6(D+)* A7(D-)* A8(SBU1)* B5(CC2)* B6(D+)* B7(D-)* B8(SBU2)*; H500 1*; H501 1*; H502 1*; H503 1*

### Notes on the sheet
- TPS65217  Test  B'd (Rev.A)
- [5] Connector
- Title
- Rev
- Doc
- Sheet #
- of
- Engineer
- This document is copyright of ArkX and shall not be revealed, produced, copied, in whole or in part,
- Date
- nor used for any purpose other than submitted.

### Library data of the parts
C500 = CAP_100nF/50V/1608: Ceramic CAP_100nF/50V/1608; LCSC Part #: C14663; JLCPCB Part Type: Basic Part
CN500 = CON_0353121060: CONN HEADER VERT 10POS 2.5MM
CN501 = CON_USB-Type-C: USB 2.0 5A 1 Surface Mount 16 Female -35℃~+75℃ Type-C SMD  USB Connectors ROHS; LCSC Part #: C2977718; JLCPCB Part Type: Extended Part
CN502 = CON_PIN_HEADER_DUAL_2x8PIN(2.54MM): PIN_HEADER_DUAL_2x8PIN(2.54MM)
CN503 = CON_0353120860: CONN HEADER VERT 8POS 2.5MM
H500-H503 = HOLE_NTH-3MM: Non-Through Hole 3mm
LED500 = LED_MHT170RGBCT(GREEN): as LED300 on sheet TPS65217DRSLR; LCSC Part #: C2962094; JLCPCB Part Type: Extended Part
R500 = RES_680R/2012/0.125W: as R306 on sheet TPS65217DRSLR; Size: 2012; LCSC Part #: C17798; JLCPCB Part Type: Basic Part
R501 = RES_1M/1608/0.1W: Value: 1M; Power Rating: 0.1W; Precision: 1%; Size: 1608; LCSC Part #: C22935; JLCPCB Part Type: Basic Part

## Nets that join several sheets
DGND: TPS65217DRSLR (41 pins), MCU (11 pins), Connector (5 pins)
DP1.1V_DCDC2: TPS65217DRSLR (C324.2 R308.2), Connector (CN500.3)
DP1.1V_DCDC3: TPS65217DRSLR (C325.2 R309.2), Connector (CN500.4)
DP1.8V_LDO1: TPS65217DRSLR (C326.2 R310.2 U300.18), Connector (CN500.5)
DP1.8VS_LDO3: TPS65217DRSLR (C328.2 R313.2), Connector (CN500.7)
DP1.35V_DCDC1: TPS65217DRSLR (C323.2 R307.2), Connector (CN500.2)
DP3.3VS_A: TPS65217DRSLR (C306.2 LED301.4 R312.2 U301.3), MCU (JP400.1)
DP3.3VS_B: TPS65217DRSLR (5 pins), MCU (JP401.1)
DP3.3VS_LDO2: TPS65217DRSLR (C327.2 R311.2 R328.1), Connector (CN500.6)
DP3.3VS_LDO4: TPS65217DRSLR (6 pins), Connector (CN500.8)
DP3.3VS_MCU: MCU (15 pins), Connector (CN502.1 CN502.2)
DP5VS: TPS65217DRSLR (20 pins), Connector (CN500.1)
GNDPWR: TPS65217DRSLR (8 pins), Connector (5 pins)
USB_5VS: TPS65217DRSLR (C322.2 R303.2 R305.2 U300.12), Connector (CN501.A4 CN501.B4 LED500.4)
MCU_GPIO_PA5: MCU (R402.1 U400.10), Connector (CN502.8)
MCU_GPIO_PA6: MCU (R403.1 U400.11), Connector (CN502.9)
MCU_GPIO_PA7: MCU (R404.1 U400.12), Connector (CN502.10)
MCU_GPIO_PA8: MCU (R405.1 U400.13), Connector (CN502.11)
MCU_GPIO_PA11: MCU (U400.14), Connector (CN502.12)
MCU_GPIO_PA12: MCU (U400.15), Connector (CN502.13)
MCU_GPIO_PC15: MCU (U400.1), Connector (CN502.14)
MCU_I2C1_SCL: TPS65217DRSLR (R319.2), MCU (U400.18), Connector (CN503.6)
MCU_I2C1_SDA: TPS65217DRSLR (R321.2), MCU (U400.19), Connector (CN503.7)
MCU_PMIC_LDO_PGOOD: TPS65217DRSLR (R325.2), MCU (U400.7), Connector (CN502.5 CN503.3)
MCU_PMIC_nINT: TPS65217DRSLR (R326.2), MCU (U400.8), Connector (CN502.6 CN503.4)
MCU_PMIC_nWAKEUP: TPS65217DRSLR (R327.2), MCU (U400.9), Connector (CN502.7 CN503.5)
MCU_PMIC_PGOOD: TPS65217DRSLR (R324.2), MCU (U400.6), Connector (CN502.4 CN503.2)
MCU_PMIC_PWR_EN: TPS65217DRSLR (R322.2), MCU (C401.2 R401.2 SW400.2 U400.5), Connector (CN502.3 CN503.1)